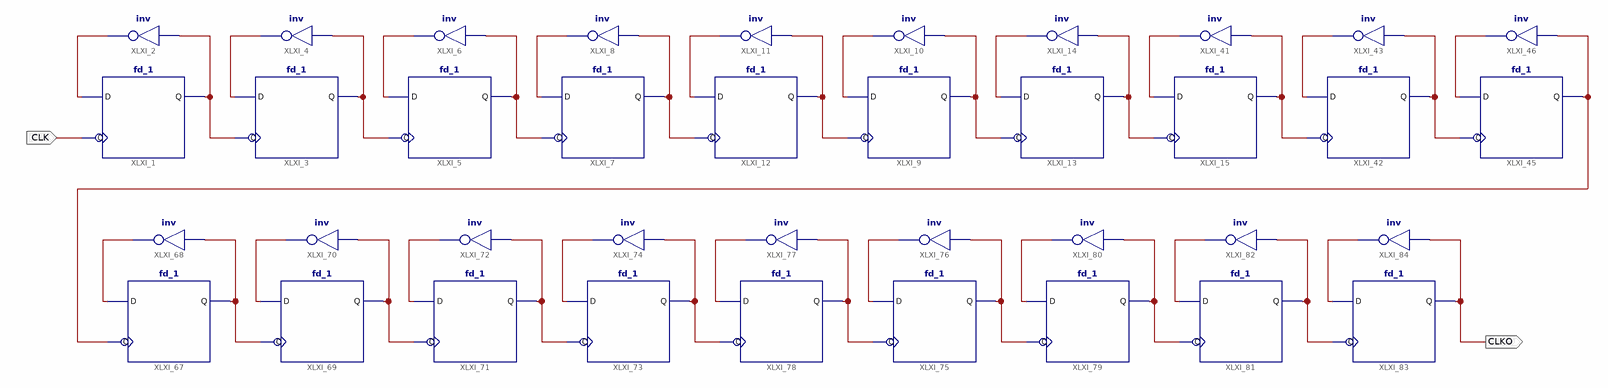
[diagram p0: schematic sheet 1]
// Xilinx ISE schematic clkdiv512ki.sch (spartan6) as structural Verilog: 38 symbols, 2 ports
module clkdiv512ki (
  input  CLK,
  output CLKO
);

  wire XLXN_3, XLXN_4, XLXN_5, XLXN_9999, XLXN_10000, XLXN_10001, XLXN_10012, XLXN_10013, XLXN_10016,
       XLXN_10017, XLXN_10018, XLXN_10019, XLXN_10020, XLXN_10021, XLXN_10022, XLXN_10023, XLXN_10024,
       XLXN_10025, XLXN_10028, XLXN_10049, XLXN_10051, XLXN_10052, XLXN_10053, XLXN_10054, XLXN_10055,
       XLXN_10056, XLXN_10057, XLXN_10058, XLXN_10059, XLXN_10060, XLXN_10061, XLXN_10062, XLXN_10063,
       XLXN_10064, XLXN_10065, XLXN_10066, XLXN_10069;

  fd_1 XLXI_1 (.C(CLK), .D(XLXN_3), .Q(XLXN_9999));
  not XLXI_2 (XLXN_3, XLXN_9999);
  fd_1 XLXI_3 (.C(XLXN_9999), .D(XLXN_5), .Q(XLXN_4));
  not XLXI_4 (XLXN_5, XLXN_4);
  fd_1 XLXI_5 (.C(XLXN_4), .D(XLXN_10001), .Q(XLXN_10000));
  not XLXI_6 (XLXN_10001, XLXN_10000);
  fd_1 XLXI_7 (.C(XLXN_10000), .D(XLXN_10012), .Q(XLXN_10013));
  not XLXI_8 (XLXN_10012, XLXN_10013);
  fd_1 XLXI_9 (.C(XLXN_10017), .D(XLXN_10018), .Q(XLXN_10019));
  not XLXI_10 (XLXN_10018, XLXN_10019);
  not XLXI_11 (XLXN_10016, XLXN_10017);
  fd_1 XLXI_12 (.C(XLXN_10013), .D(XLXN_10016), .Q(XLXN_10017));
  fd_1 XLXI_13 (.C(XLXN_10019), .D(XLXN_10020), .Q(XLXN_10021));
  not XLXI_14 (XLXN_10020, XLXN_10021);
  fd_1 XLXI_15 (.C(XLXN_10021), .D(XLXN_10022), .Q(XLXN_10023));
  not XLXI_41 (XLXN_10022, XLXN_10023);
  fd_1 XLXI_42 (.C(XLXN_10023), .D(XLXN_10024), .Q(XLXN_10025));
  not XLXI_43 (XLXN_10024, XLXN_10025);
  fd_1 XLXI_45 (.C(XLXN_10025), .D(XLXN_10028), .Q(XLXN_10069));
  not XLXI_46 (XLXN_10028, XLXN_10069);
  fd_1 XLXI_67 (.C(XLXN_10069), .D(XLXN_10051), .Q(XLXN_10049));
  not XLXI_68 (XLXN_10051, XLXN_10049);
  fd_1 XLXI_69 (.C(XLXN_10049), .D(XLXN_10053), .Q(XLXN_10052));
  not XLXI_70 (XLXN_10053, XLXN_10052);
  fd_1 XLXI_71 (.C(XLXN_10052), .D(XLXN_10055), .Q(XLXN_10054));
  not XLXI_72 (XLXN_10055, XLXN_10054);
  fd_1 XLXI_73 (.C(XLXN_10054), .D(XLXN_10056), .Q(XLXN_10059));
  not XLXI_74 (XLXN_10056, XLXN_10059);
  fd_1 XLXI_75 (.C(XLXN_10060), .D(XLXN_10057), .Q(XLXN_10058));
  not XLXI_76 (XLXN_10057, XLXN_10058);
  not XLXI_77 (XLXN_10061, XLXN_10060);
  fd_1 XLXI_78 (.C(XLXN_10059), .D(XLXN_10061), .Q(XLXN_10060));
  fd_1 XLXI_79 (.C(XLXN_10058), .D(XLXN_10062), .Q(XLXN_10063));
  not XLXI_80 (XLXN_10062, XLXN_10063);
  fd_1 XLXI_81 (.C(XLXN_10063), .D(XLXN_10064), .Q(XLXN_10065));
  not XLXI_82 (XLXN_10064, XLXN_10065);
  fd_1 XLXI_83 (.C(XLXN_10065), .D(XLXN_10066), .Q(CLKO));
  not XLXI_84 (XLXN_10066, CLKO);
endmodule
